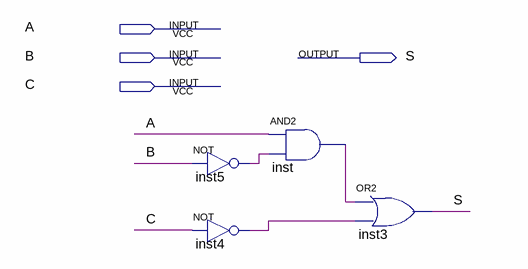
[diagram p0: schematic sheet]
// Quartus schematic Practica_1.bdf as structural Verilog: 4 symbols, 4 pins
module Practica_1 (
  input  A,
  input  B,
  input  C,
  output S
);

  wire inst4_out, inst5_out, inst_out;

  not inst5 (inst5_out, B);
  not inst4 (inst4_out, C);
  and inst (inst_out, A, inst5_out);
  or inst3 (S, inst_out, inst4_out);
endmodule
